# EAGLE design BBBL-CAN-Motor-Interface (EAGLE 9.1.1)
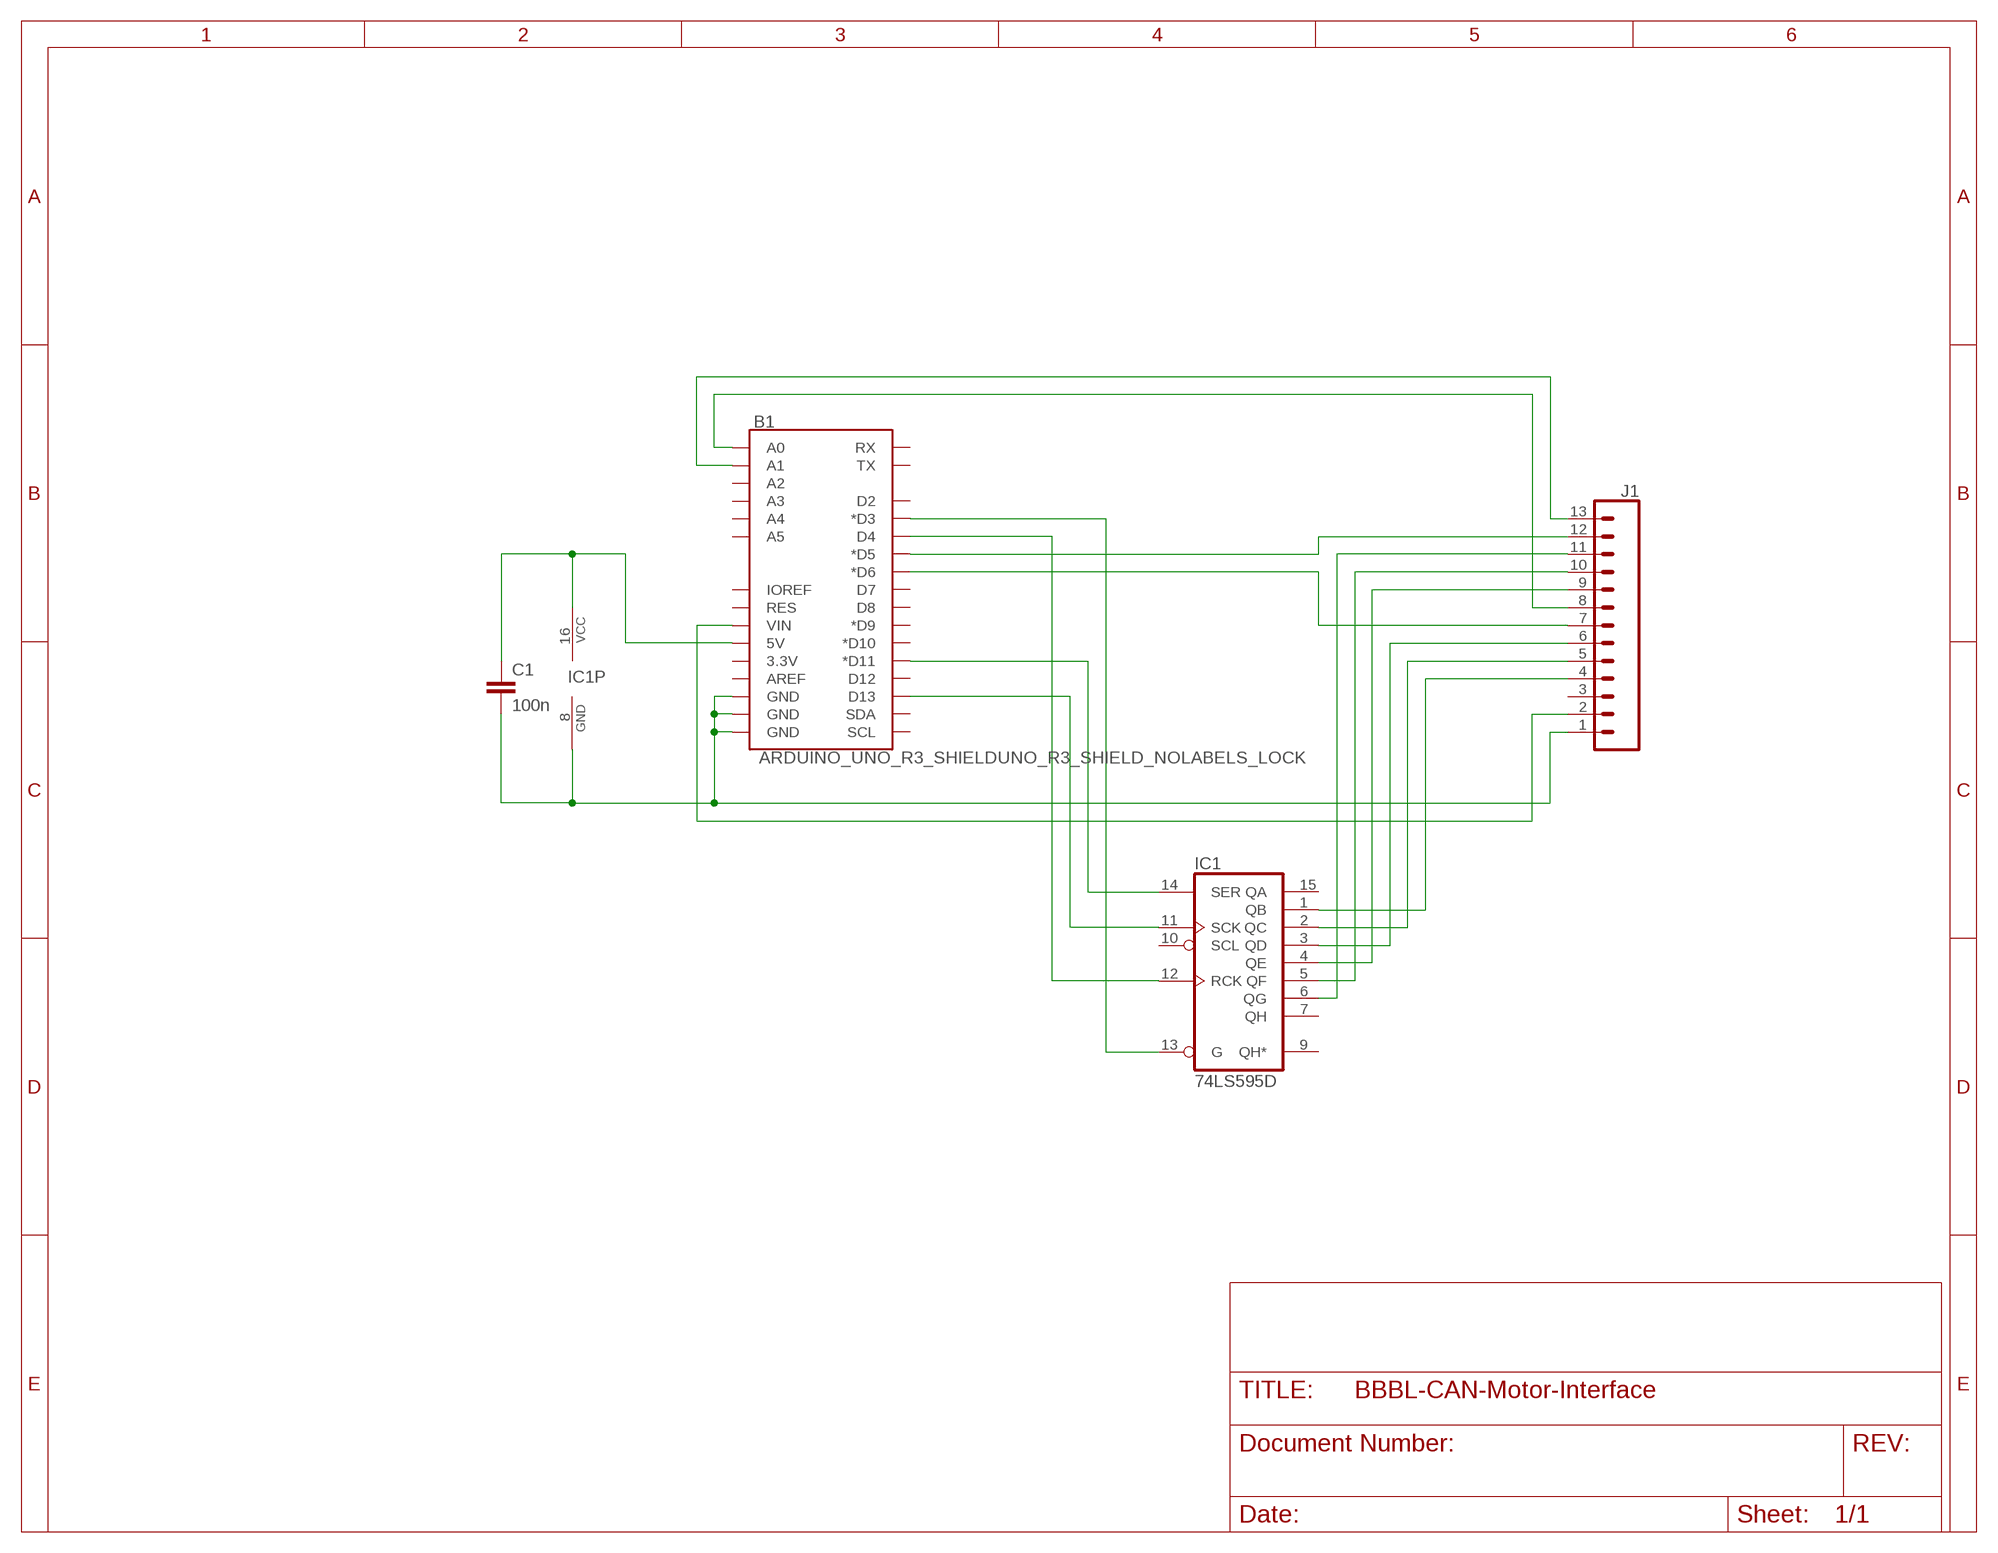
[diagram p0: schematic, sheet 1]

## Parts
B1  ARDUINO_UNO_R3_SHIELDUNO_R3_SHIELD_NOLABELS_LOCK  [UNO_R3_SHIELD_NOLABELS_LOCK]
C1  100n  C-EUC0603  [C0603]
IC1  74LS595D  [SO16]
J1  CONN_13LOCK  [1X13_LOCK]

## Nets
GND: B1.GND@0(GND) B1.GND@1(GND) B1.GND@2(GND) C1.2 IC1.8(GND) J1.1
N$1: B1.D5(*D5) J1.12
N$2: B1.A0 J1.8
N$3: B1.A1 J1.13
N$4: B1.D6(*D6) J1.7
N$5: IC1.6(QG) J1.11
N$6: IC1.5(QF) J1.10
N$7: IC1.4(QE) J1.9
N$8: IC1.3(QD) J1.6
N$9: IC1.2(QC) J1.5
N$10: IC1.1(QB) J1.4
N$11: B1.D3(*D3) IC1.13(G)
N$12: B1.VIN J1.2
N$13: B1.D11(*D11) IC1.14(SER)
N$14: B1.D13 IC1.11(SCK)
N$15: B1.D4 IC1.12(RCK)
N$16: B1.5V C1.1 IC1.16(VCC)
Unconnected: B1.3.3V B1.A2 B1.A3 B1.A4 B1.A5 B1.AREF B1.D2 B1.D7 B1.D8 B1.D9(*D9) B1.D10(*D10) B1.D12 B1.IOREF B1.RES B1.RX B1.SCL B1.SDA B1.TX IC1.7(QH) IC1.9(QH*) IC1.10(SCL) IC1.15(QA) J1.3

## Library data of the parts
B1 = SparkFun-Boards:ARDUINO_UNO_R3_SHIELD: Arduino R3 Shield Footprint Shield form compatible with the Arduino Uno R3. SparkFun Products: MG2639 Cellular Shield <https://www.sparkfun.com/products/13120> MIDI Shield <https://www.sparkfun.com/products/12898> R3 Stackable Headers Kit <https://www.sparkfun.com/products/11417>
C1 = resistor:C-EU: CAPACITOR, European symbol
IC1 = 74xx-us:74*595: 8-bit SHIFT REGISTER, output latch
J1 = SparkFun-Connectors:CONN_13: Multi connection point. Often used as Generic Header-pin footprint for 0.1 inch spaced/style header connections On any of the 0.1 inch spaced packages, you can populate with these: Break Away Headers - Straight <https://www.sparkfun.com/products/116> (PRT-00116) Break Away Male Headers - Right Angle <https://www.sparkfun.com/products/553> (PRT-00553) Female Headers <https://www.sparkfun.com/products/115> (PRT-00115) Break Away Headers - Machine Pin <https://www.sparkfun.com/products/117> (PRT-00117) Break Away Female Headers - Swiss Machine Pin <https://www.sparkfun.com/products/743> (PRT-00743) For SCREWTERMINALS and SPRING TERMINALS visit here: Screw Terimnals on SparkFun.com <https://www.sparkfun.com/search/results?term=Screw+Terminals> (5mm/3.5mm/2.54mm spacing) This device is also useful as a general connection point to wire up your design to another part of your project. Our various solder wires solder well into these plated through hole pads. Hook-Up Wire - Assortment (Stranded, 22 AWG) <https://www.sparkfun.com/products/11375> (PRT-11375) Hook-Up Wire - Assortment (Solid Core, 22 AWG) <https://www.sparkfun.com/products/11367> (PRT-11367) View the entire wire category on our website here <https://www.sparkfun.com/categories/141> Special notes: Molex polarized connector foot print use with SKU : PRT-08231 with associated crimp pins and housings. 1MM SMD Version SKU: PRT-10208 NOTES ON THE VARIANTS LOCK and LOCK_LONGPADS... This footprint was designed to help hold the alignment of a through-hole component (i.e. 6-pin header) while soldering it into place. You may notice that each hole has been shifted either up or down by 0.005 of an inch from it's more standard position (which is a perfectly straight line). This slight alteration caused the pins (the squares in the middle) to touch the edges of the holes. Because they are alternating, it causes a "brace" to hold the component in place. 0.005 has proven to be the perfect amount of "off-center" position when using our standard breakaway headers. Although looks a little odd when you look at the bare footprint, once you have a header in there, the alteration is very hard to notice. Also,if you push a header all the way into place, it is covered up entirely on the bottom side.

## Board
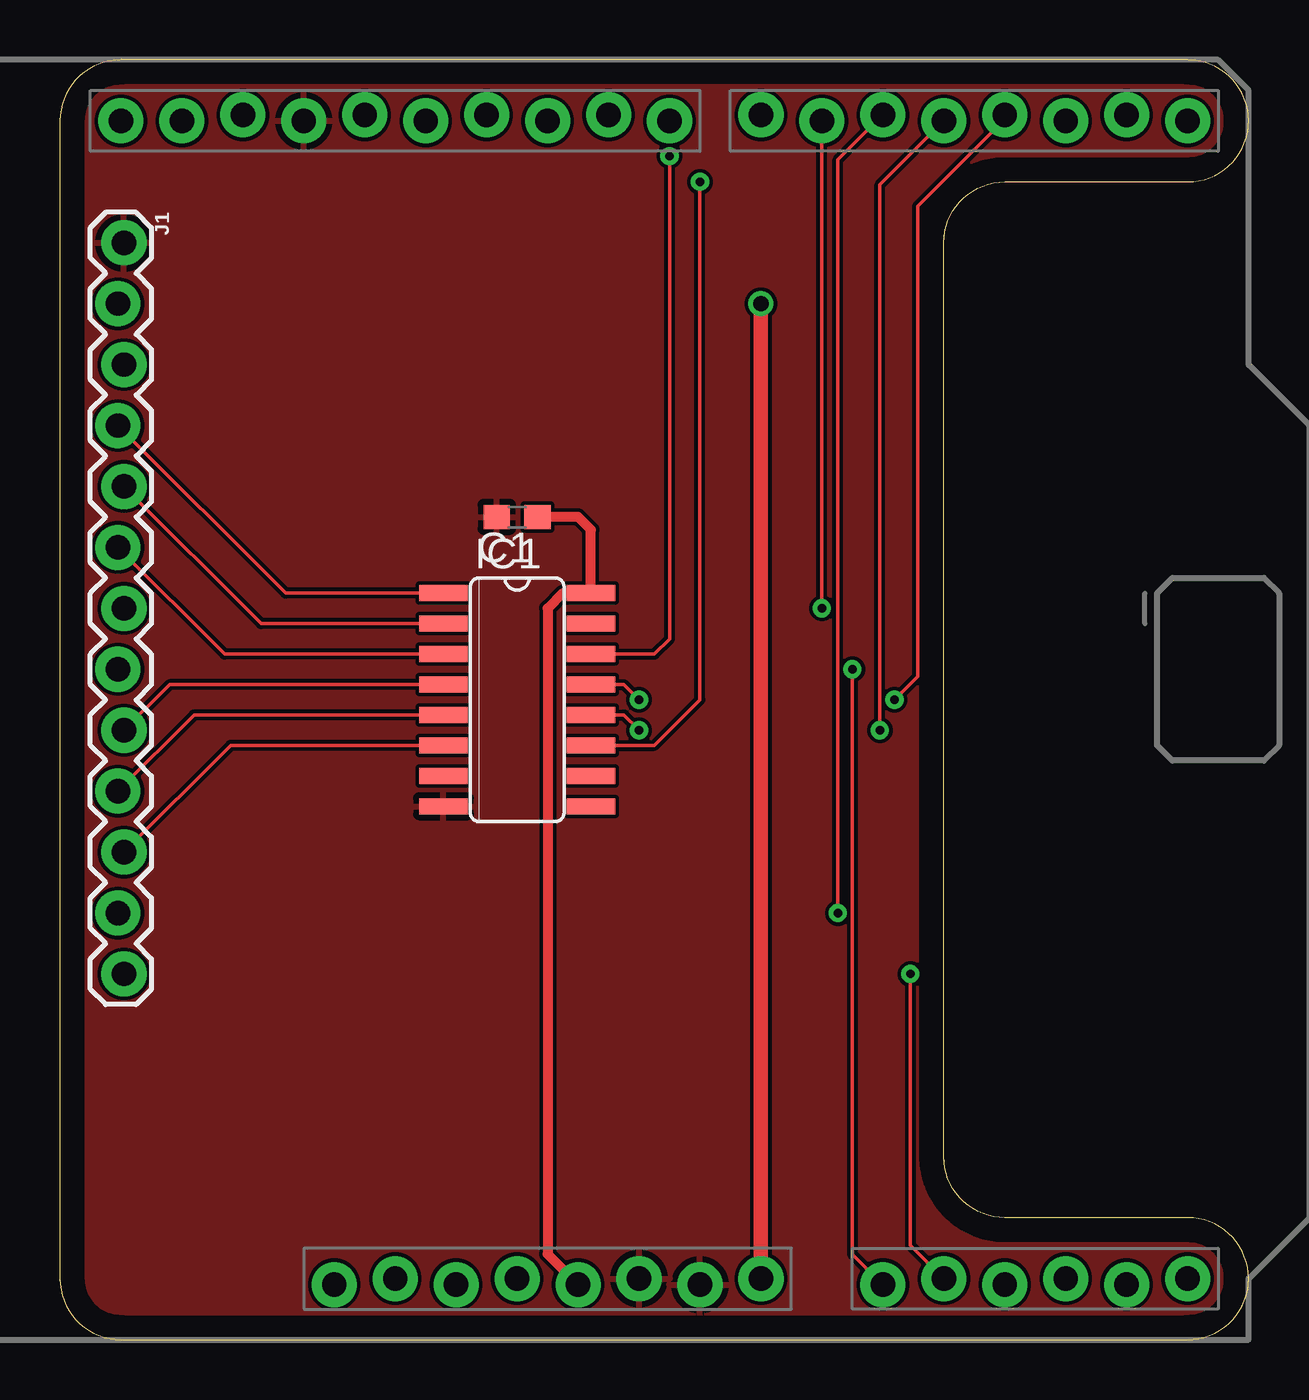
[diagram p1: board, top side]
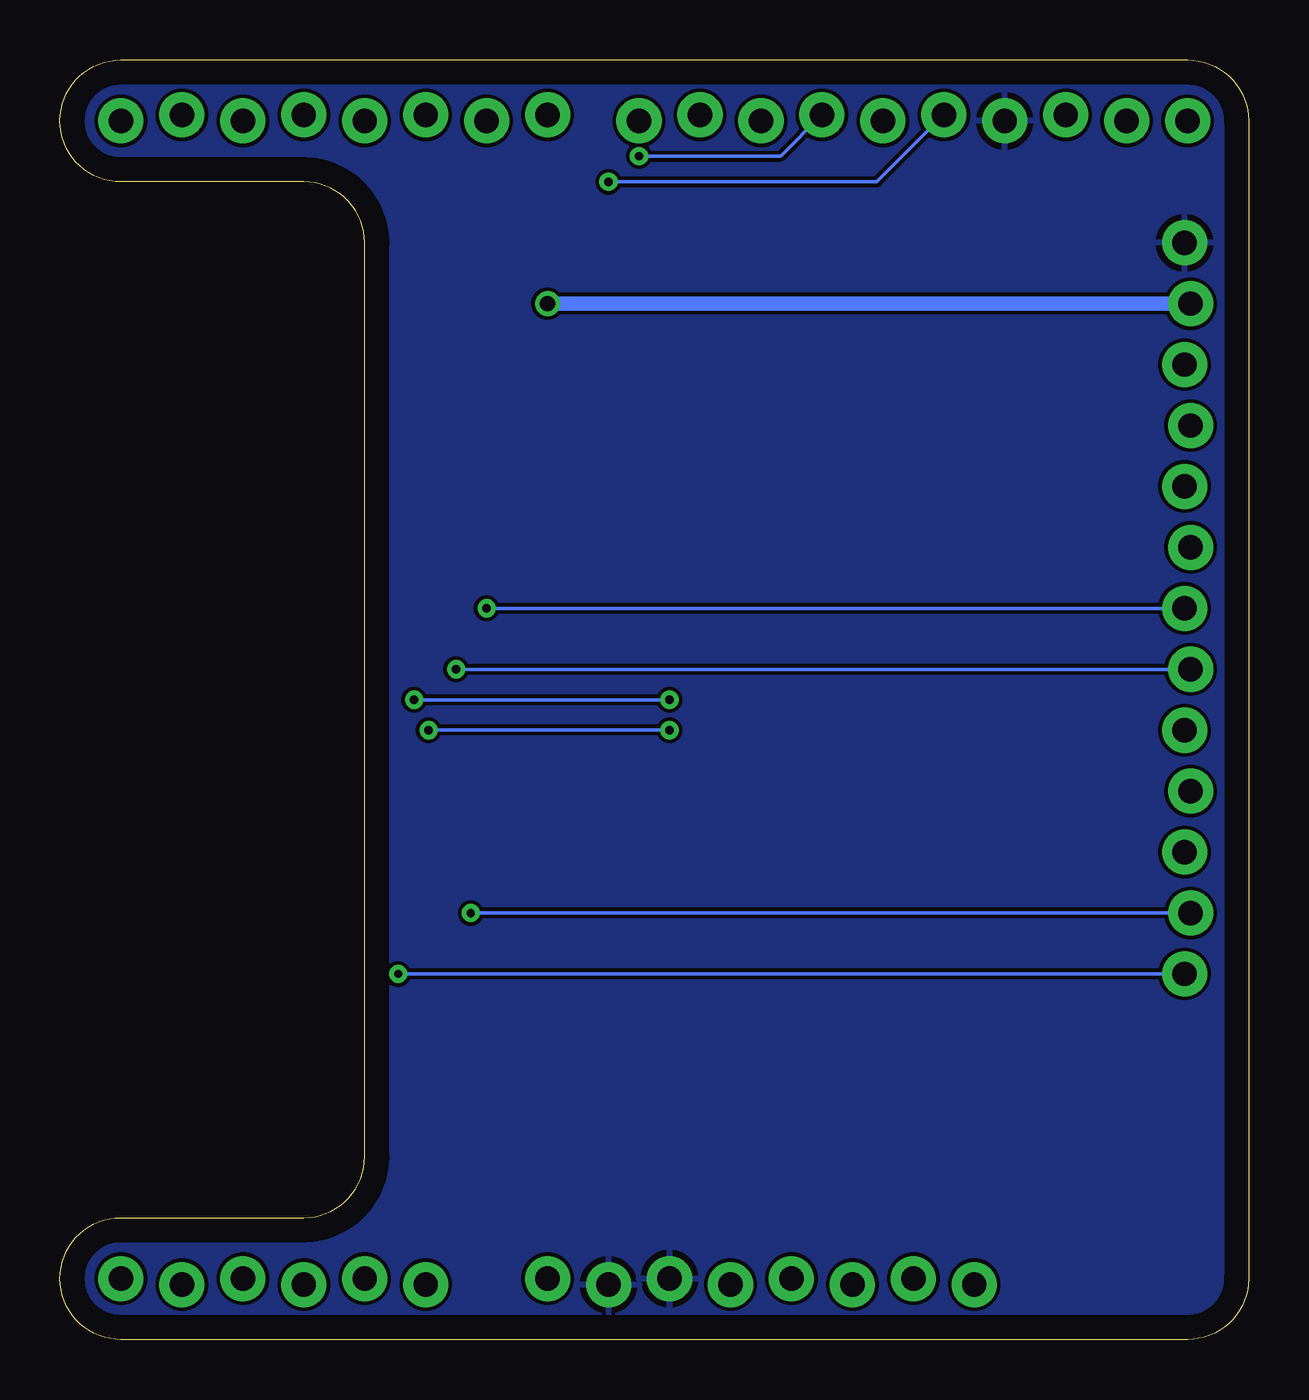
[diagram p2: board, bottom side, seen from below]

Size 49.53 x 53.34 mm. Coordinates in mm from the lower left corner, seen from the top.
Outline: 0,50.8 0,2.54 arc90 2.54,0 46.99,0 arc90 49.53,2.54 arc90 46.99,5.08 39.37,5.08 arc-90 36.83,7.62 36.83,45.72 arc-90 39.37,48.26 46.99,48.26 arc90 49.53,50.8 arc90 46.99,53.34 2.54,53.34 arc90 0,50.8
Copper layers (1*16): Top 0.035mm / dielectric 1.5mm / Bottom 0.035mm
Design rules "default": minimum track width 6mil, minimum drill 0.35mm, track to track 6mil, track to pad 6mil, pad to pad 6mil, via to via 6mil, smd to smd 6mil, copper to edge 40mil, drill to drill 6mil, minimum pad ring 10mil, minimum via ring 8mil, stop-mask expansion 4mil, vias tented up to drill 0mil, thermal gap 10mil

### Footprints (pad centres in the part's own frame; a part is rotated, then mirrored left to right if it is on the bottom)
UNO_R3_SHIELD_NOLABELS_LOCK = drill 1.016 pad 1.88: 3.3V 24.13,-3.81; 5V 24.384,-1.27; A0 24.384,11.43; A1 24.13,13.97; A2 24.384,16.51; A3 24.13,19.05; A4 24.384,21.59; A5 24.13,24.13; AREF -24.384,-15.24; D2 -24.13,19.05; D3 -24.384,16.51; D4 -24.13,13.97; D5 -24.384,11.43; D6 -24.13,8.89; D7 -24.384,6.35; D8 -24.13,2.54; D9 -24.384,0; D10 -24.13,-2.54; D11 -24.384,-5.08; D12 -24.13,-7.62; D13 -24.384,-10.16; GND@0 24.13,1.27; GND@1 24.384,3.81; GND@2 -24.13,-12.7; IOREF 24.13,-8.89; NC 24.384,-11.43; RES 24.384,-6.35; RX -24.13,24.13; SCL -24.13,-20.32; SDA -24.13,-17.78; TX -24.384,21.59; VIN 24.13,6.35
C0603 = smd 1.1 x 1: 1 -0.85,0; 2 0.85,0
SO16 = smd 0.66 x 2.032: 1 -4.445,-3.073; 2 -3.175,-3.073; 3 -1.905,-3.073; 4 -0.635,-3.073; 5 0.635,-3.073; 6 1.905,-3.073; 7 3.175,-3.073; 8 4.445,-3.073; 9 4.445,3.073; 10 3.175,3.073; 11 1.905,3.073; 12 0.635,3.073; 13 -0.635,3.073; 14 -1.905,3.073; 15 -3.175,3.073; 16 -4.445,3.073
1X13_LOCK = drill 1.016 pad 1.88: 1 0,0.127; 2 2.54,-0.127; 3 5.08,0.127; 4 7.62,-0.127; 5 10.16,0.127; 6 12.7,-0.127; 7 15.24,0.127; 8 17.78,-0.127; 9 20.32,0.127; 10 22.86,-0.127; 11 25.4,0.127; 12 27.94,-0.127; 13 30.48,0.127

### Placement (x,y rotation side)
B1  22.86,26.67 270 top
C1  19.05,34.29 180 top
IC1  19.05,26.67 270 top
J1  2.54,45.72 270 top

### Tracks (layer width: path | path; a pad name or v marks a point on that pad's centre or on a via)
GND
  pour Top: -1.27,-1.27 50.8,-1.27 50.8,54.61 -1.27,54.61
  pour Bottom: -2.54,-2.54 52.07,-2.54 52.07,55.88 -2.54,55.88
N$1  (via drill 0.35)
  Top 0.152: v32.41,17.78 32.41,49.18 B1.D5
  Bottom 0.152: J1.12 v32.41,17.78
N$2  (via drill 0.35)
  Top 0.152: v33.02,27.94 33.02,3.56 B1.A0
  Bottom 0.152: J1.8 v33.02,27.94
N$3  (via drill 0.35)
  Top 0.152: v35.44,15.24 35.44,3.93 B1.A1
  Bottom 0.152: J1.13 v35.44,15.24
N$4  (via drill 0.35)
  Top 0.152: v31.75,30.48 B1.D6
  Bottom 0.152: J1.7 v31.75,30.48
N$5
  Top 0.152: IC1.6 7.11,24.77 J1.11
N$6
  Top 0.152: IC1.5 5.59,26.04 J1.10
N$7
  Top 0.152: IC1.4 4.57,27.3 J1.9
N$8
  Top 0.152: IC1.3 6.86,28.57 J1.6
N$9
  Top 0.152: IC1.2 8.38,29.84 J1.5
N$10
  Top 0.152: IC1.1 9.4,31.11 J1.4
N$11  (via drill 0.35)
  Top 0.152: IC1.13 23.5,27.3 v24.13,26.67 | v34.77,26.67 35.74,27.64 35.74,47.24 39.37,50.88 B1.D3
  Bottom 0.152: v24.13,26.67 v34.77,26.67
N$12  (via drill 0.64)
  Top 0.61: v29.21,43.18 B1.VIN
  Bottom 0.61: J1.2 v29.21,43.18
N$13  (via drill 0.35)
  Top 0.152: IC1.14 24.77,28.57 25.4,29.21 v25.4,49.33
  Bottom 0.152: v25.4,49.33 19.5,49.33 B1.D11
N$14  (via drill 0.35)
  Top 0.152: IC1.11 24.77,24.77 26.67,26.67 v26.67,48.26
  Bottom 0.152: v26.67,48.26 15.49,48.26 B1.D13
N$15  (via drill 0.35)
  Top 0.152: IC1.12 23.5,26.04 v24.13,25.4 | v34.17,25.4 34.17,48.14 B1.D4
  Bottom 0.152: v24.13,25.4 v34.17,25.4
N$16
  Top 0.406: C1.1 21.59,34.29 22.12,33.76 IC1.16 20.95,31.11 20.32,30.48 20.32,3.56 B1.5V